# Altium schematic sheet logic6_main.SchDoc: mcHF QRP Transceiver UI board
size A4; Author: K Atanassov; CompanyName: M0NKA; Revision: 0.6.3; SheetTotal: 5
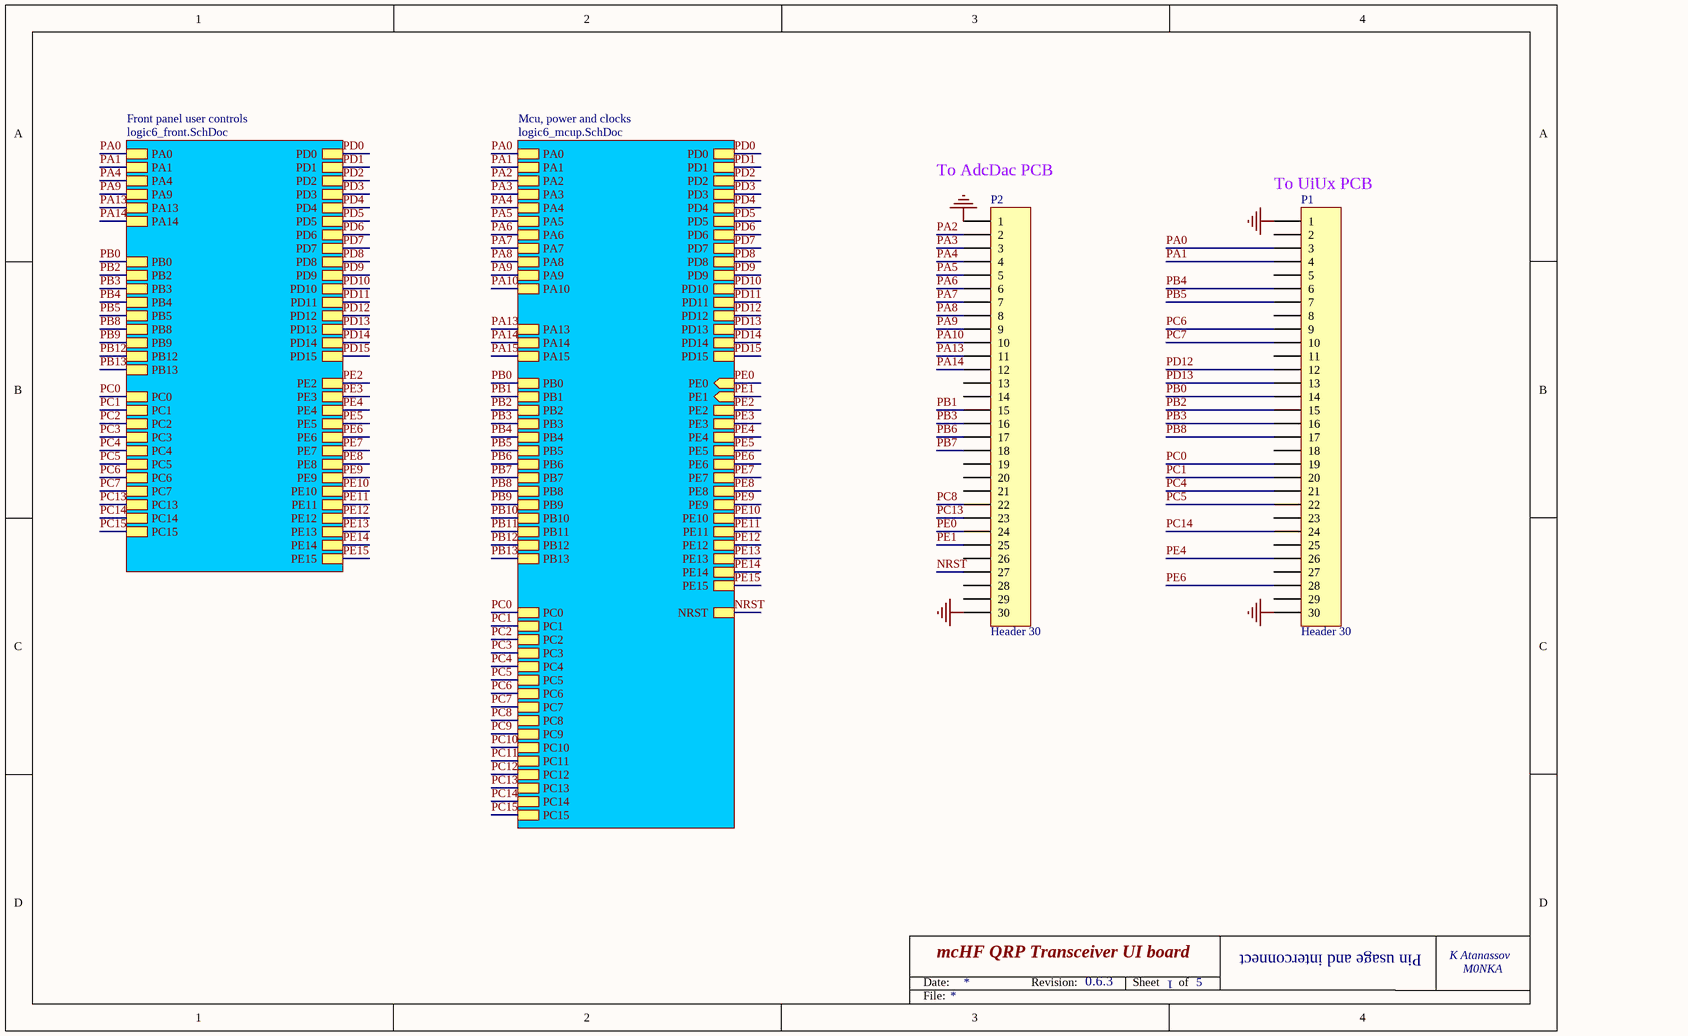
[diagram p0: logic6_main.SchDoc]

## Parts
P1  Header 30  [HDR1X30]
P2  Header 30  [HDR1X30]

## Sub-sheets
Front panel user controls = logic6_front.SchDoc: PA0, PA1, PB3, PB2, PB0, PB8, PB9, PB12, PB13, PB4, PB5, PC0, PC1, PC2, PC3, PC4, PC5, PC6, PC7, PC13, PC14, PC15, PD0, PD1, PD2, PD3, PD4, PD5, PD6, PD7, PD8, PD9, PD10, PD12, PD11, PD13, PD14, PD15, PE2, PE3, PE4, PE5, PE6, PE7, PE8, PE9, PE10, PE11, PE12, PE13, PE14, PE15, PA13, PA14, PA4, PA9
Mcu, power and clocks = logic6_mcup.SchDoc: PD0, PD1, PD2, PD3, PE1 (in), PD4, PD5, PD6, PD7, PD8, PD9, PD10, PD11, PD12, PD13, PD14, PD15, PE2, PE3, PE4, PE5, PE6, PE7, PE8, PE9, PE10, PE11, PE12, PE13, PE14, PE15, PA0, PA1, PA2, PA3, PA4, PA5, PA6, PA7, PA8, PA9, PA10, PA13, PA14, PA15, PE0 (in), PB0, PB1, PB3, PB4, PB5, PB6, PB8, PB7, PB9, PB10, PB11, PB12, PB13, PC1, PC0, PC2, PC3, PC4, PC5, PC6, PC7, PC8, PC9, PC10, PC11, PC12, PC13, PC14, PC15, PB2, NRST

## Nets
GND: P1.1 P1.30 P2.1 P2.30
NRST: P2.27 ; sheet Mcu, power and clocks/NRST
PA0: P1.3 ; sheet Mcu, power and clocks/PA0, sheet Front panel user controls/PA0
PA1: P1.4 ; sheet Mcu, power and clocks/PA1, sheet Front panel user controls/PA1
PA2: P2.2 ; sheet Mcu, power and clocks/PA2
PA3: P2.3 ; sheet Mcu, power and clocks/PA3
PA4: P2.4 ; sheet Mcu, power and clocks/PA4, sheet Front panel user controls/PA4
PA5: P2.5 ; sheet Mcu, power and clocks/PA5
PA6: P2.6 ; sheet Mcu, power and clocks/PA6
PA7: P2.7 ; sheet Mcu, power and clocks/PA7
PA8: P2.8 ; sheet Mcu, power and clocks/PA8
PA9: P2.9 ; sheet Mcu, power and clocks/PA9, sheet Front panel user controls/PA9
PA10: P2.10 ; sheet Mcu, power and clocks/PA10
PA13: P2.11 ; sheet Mcu, power and clocks/PA13, sheet Front panel user controls/PA13
PA14: P2.12 ; sheet Mcu, power and clocks/PA14, sheet Front panel user controls/PA14
PA15: sheet Mcu, power and clocks/PA15
PB0: P1.14 ; sheet Mcu, power and clocks/PB0, sheet Front panel user controls/PB0
PB1: P2.15 ; sheet Mcu, power and clocks/PB1
PB2: P1.15 ; sheet Mcu, power and clocks/PB2, sheet Front panel user controls/PB2
PB3: P1.16 P2.16 ; sheet Mcu, power and clocks/PB3, sheet Front panel user controls/PB3
PB4: P1.6 ; sheet Mcu, power and clocks/PB4, sheet Front panel user controls/PB4
PB5: P1.7 ; sheet Mcu, power and clocks/PB5, sheet Front panel user controls/PB5
PB6: P2.17 ; sheet Mcu, power and clocks/PB6
PB7: P2.18 ; sheet Mcu, power and clocks/PB7
PB8: P1.17 ; sheet Mcu, power and clocks/PB8, sheet Front panel user controls/PB8
PB9: sheet Mcu, power and clocks/PB9, sheet Front panel user controls/PB9
PB10: sheet Mcu, power and clocks/PB10
PB11: sheet Mcu, power and clocks/PB11
PB12: sheet Mcu, power and clocks/PB12, sheet Front panel user controls/PB12
PB13: sheet Mcu, power and clocks/PB13, sheet Front panel user controls/PB13
PC0: P1.19 ; sheet Mcu, power and clocks/PC0, sheet Front panel user controls/PC0
PC1: P1.20 ; sheet Mcu, power and clocks/PC1, sheet Front panel user controls/PC1
PC2: sheet Mcu, power and clocks/PC2, sheet Front panel user controls/PC2
PC3: sheet Mcu, power and clocks/PC3, sheet Front panel user controls/PC3
PC4: P1.21 ; sheet Mcu, power and clocks/PC4, sheet Front panel user controls/PC4
PC5: P1.22 ; sheet Mcu, power and clocks/PC5, sheet Front panel user controls/PC5
PC6: P1.9 ; sheet Mcu, power and clocks/PC6, sheet Front panel user controls/PC6
PC7: P1.10 ; sheet Mcu, power and clocks/PC7, sheet Front panel user controls/PC7
PC8: P2.22 ; sheet Mcu, power and clocks/PC8
PC9: sheet Mcu, power and clocks/PC9
PC10: sheet Mcu, power and clocks/PC10
PC11: sheet Mcu, power and clocks/PC11
PC12: sheet Mcu, power and clocks/PC12
PC13: P2.23 ; sheet Mcu, power and clocks/PC13, sheet Front panel user controls/PC13
PC14: P1.24 ; sheet Mcu, power and clocks/PC14, sheet Front panel user controls/PC14
PC15: sheet Mcu, power and clocks/PC15, sheet Front panel user controls/PC15
PD0: sheet Mcu, power and clocks/PD0, sheet Front panel user controls/PD0
PD1: sheet Mcu, power and clocks/PD1, sheet Front panel user controls/PD1
PD2: sheet Mcu, power and clocks/PD2, sheet Front panel user controls/PD2
PD3: sheet Mcu, power and clocks/PD3, sheet Front panel user controls/PD3
PD4: sheet Mcu, power and clocks/PD4, sheet Front panel user controls/PD4
PD5: sheet Mcu, power and clocks/PD5, sheet Front panel user controls/PD5
PD6: sheet Mcu, power and clocks/PD6, sheet Front panel user controls/PD6
PD7: sheet Mcu, power and clocks/PD7, sheet Front panel user controls/PD7
PD8: sheet Mcu, power and clocks/PD8, sheet Front panel user controls/PD8
PD9: sheet Mcu, power and clocks/PD9, sheet Front panel user controls/PD9
PD10: sheet Mcu, power and clocks/PD10, sheet Front panel user controls/PD10
PD11: sheet Mcu, power and clocks/PD11, sheet Front panel user controls/PD11
PD12: P1.12 ; sheet Mcu, power and clocks/PD12, sheet Front panel user controls/PD12
PD13: P1.13 ; sheet Mcu, power and clocks/PD13, sheet Front panel user controls/PD13
PD14: sheet Mcu, power and clocks/PD14, sheet Front panel user controls/PD14
PD15: sheet Mcu, power and clocks/PD15, sheet Front panel user controls/PD15
PE0: P2.24 ; sheet Mcu, power and clocks/PE0
PE1: P2.25 ; sheet Mcu, power and clocks/PE1
PE2: sheet Mcu, power and clocks/PE2, sheet Front panel user controls/PE2
PE3: sheet Mcu, power and clocks/PE3, sheet Front panel user controls/PE3
PE4: P1.26 ; sheet Mcu, power and clocks/PE4, sheet Front panel user controls/PE4
PE5: sheet Mcu, power and clocks/PE5, sheet Front panel user controls/PE5
PE6: P1.28 ; sheet Mcu, power and clocks/PE6, sheet Front panel user controls/PE6
PE7: sheet Mcu, power and clocks/PE7, sheet Front panel user controls/PE7
PE8: sheet Mcu, power and clocks/PE8, sheet Front panel user controls/PE8
PE9: sheet Mcu, power and clocks/PE9, sheet Front panel user controls/PE9
PE10: sheet Mcu, power and clocks/PE10, sheet Front panel user controls/PE10
PE11: sheet Mcu, power and clocks/PE11, sheet Front panel user controls/PE11
PE12: sheet Mcu, power and clocks/PE12, sheet Front panel user controls/PE12
PE13: sheet Mcu, power and clocks/PE13, sheet Front panel user controls/PE13
PE14: sheet Mcu, power and clocks/PE14, sheet Front panel user controls/PE14
PE15: sheet Mcu, power and clocks/PE15, sheet Front panel user controls/PE15

Not connected (* = marked no-connect by the designer): P1 2 5 8 11 18 23 25 27 29; P2 13 14 19 20 21 26 28 29

## Notes on the sheet
- (near P2) To AdcDac PCB
- (near P1) To UiUx PCB
- 1
- Pin usage and interconnect
- Date:
- Revision:
- Sheet
- of
- File:

## Library data of the parts
P1 P2 = Header 30: Header, 30-Pin; Order: NA; Price: 0.295